# EAGLE schematic LineDriver (EAGLE 6.3)
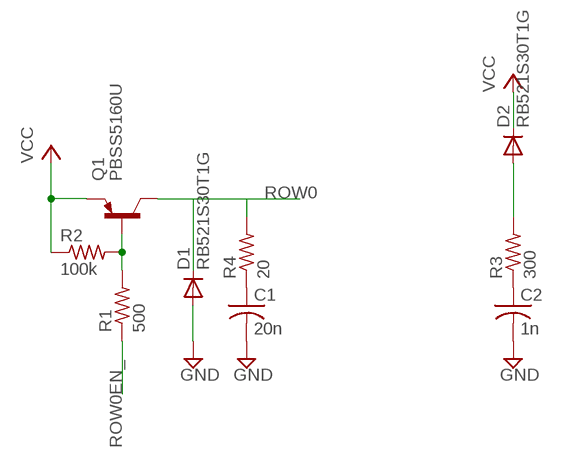
[diagram p0: schematic, sheet 1]

## Parts
C1  20n  C-USC0805  [C0805]
C2  1n  C-USC0805  [C0805]
D1  RB521S30T1G  DIODE-SOD523  [SOD523]
D2  RB521S30T1G  DIODE-SOD523  [SOD523]
Q1  PBSS5160U  -PNP-SOT23-BCE  [SOT23-BCE]
R1  500  R-US_R0805  [R0805]
R2  100k  R-US_R0805  [R0805]
R3  300  R-US_R0805  [R0805]
R4  20  R-US_R0805  [R0805]

## Nets
GND: C1.2 C2.2 D1.A
N$2: Q1.B R1.2 R2.2
N$4: C1.1 R4.1
N$5: D2.A R3.2
N$6: C2.1 R3.1
ROW0: D1.C Q1.C R4.2
ROW0EN_: R1.1
VCC: D2.C Q1.E R2.1

## Library data of the parts
C1 C2 = resistor:C-US: CAPACITOR, American symbol
D1 D2 = diode:DIODE-: DIODE
Q1 = transistor:*-PNP-: PNP Transistror
R1-R4 = resistor:R-US_: RESISTOR, American symbol